# EAGLE schematic 1.28TFT (EAGLE 9.4.2)
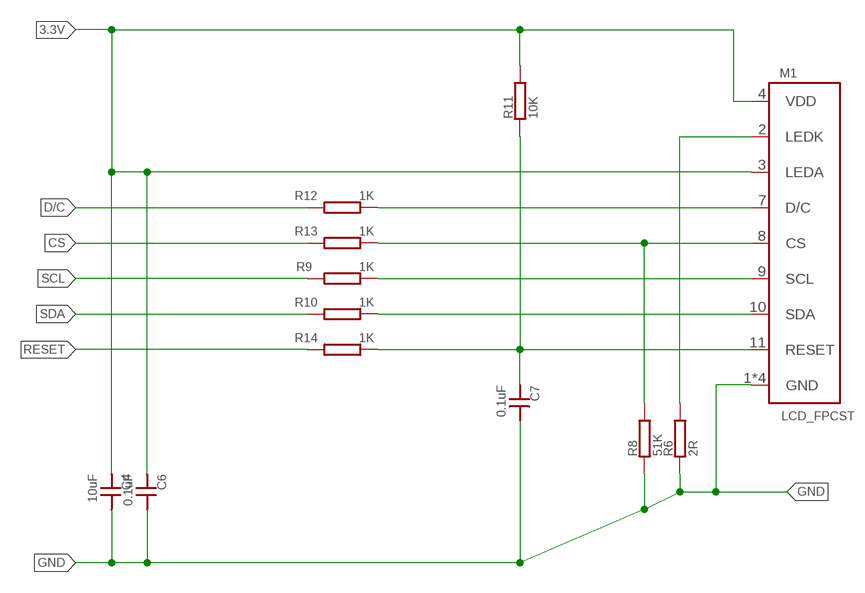
[diagram p0: schematic, sheet 1]

## Parts
C4  10uF  C0603  [0603]
C6  0.1uF  C0603  [0603]
C7  0.1uF  C0603  [0603]
M1  LCD_FPCST  [FR-128HR01A]
R6  2R  R0603  [0603]
R8  51K  R0603  [0603]
R9  1K  R0603  [0603]
R10  1K  R0603  [0603]
R11  10K  R0603  [0603]
R12  1K  R0603  [0603]
R13  1K  R0603  [0603]
R14  1K  R0603  [0603]

## Nets
3.3V: C4.P$1 C6.P$1 M1.3(LEDA) M1.4(VDD) R11.P$2
CS: R13.P$2
D/C: R12.P$2
GND: C4.P$2 C6.P$2 C7.P$2 M1.1(GND) M1.5(GND) M1.6(GND) M1.12(GND) R6.P$1 R8.P$1
N$1: M1.2(LEDK) R6.P$2
N$2: M1.8(CS) R8.P$2 R13.P$1
N$3: M1.9(SCL) R9.P$1
N$4: M1.10(SDA) R10.P$1
N$5: M1.7(D/C) R12.P$1
RESET: R14.P$2
RST: C7.P$1 M1.11(RESET) R11.P$1 R14.P$1
SCL: R9.P$2
SDA: R10.P$2

## Library data of the parts
C4 C6 C7 = LARS_409_R,C,L:C
M1 = LARS_409_MODULES:LCD_FPC
R6 R8-R14 = LARS_409_R,C,L:R